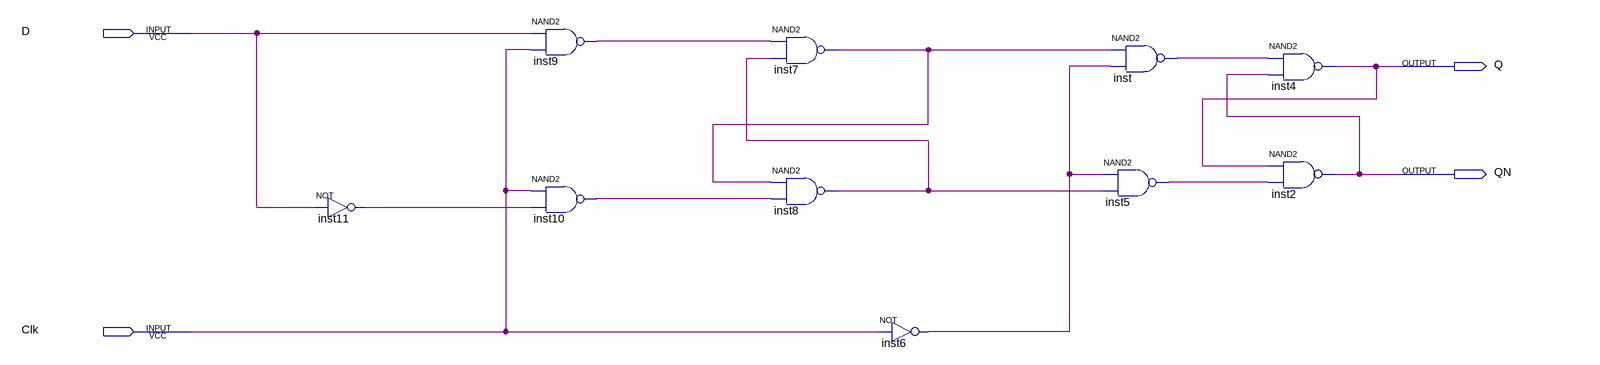
[diagram p0: schematic sheet]
// Quartus schematic lab9step3a.bdf as structural Verilog: 10 symbols, 4 pins
module lab9step3a (
  input  D,
  input  Clk,
  output Q,
  output QN
);

  wire inst5_out, inst6_out, inst7_out, inst8_out, inst9_out, inst10_out, inst11_out, inst_out;

  not inst11 (inst11_out, D);
  nand inst9 (inst9_out, D, Clk);
  nand inst10 (inst10_out, Clk, inst11_out);
  nand inst7 (inst7_out, inst9_out, inst8_out);
  nand inst8 (inst8_out, inst7_out, inst10_out);
  not inst6 (inst6_out, Clk);
  nand inst (inst_out, inst7_out, inst6_out);
  nand inst5 (inst5_out, inst6_out, inst8_out);
  nand inst4 (Q, inst_out, QN);
  nand inst2 (QN, Q, inst5_out);
endmodule
